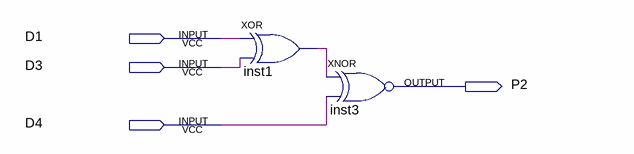
[diagram p0: schematic sheet]
// Quartus schematic generate_p2.bdf as structural Verilog: 2 symbols, 4 pins
module generate_p2 (
  input  D1,
  input  D3,
  input  D4,
  output P2
);

  wire inst1_out;

  xor inst1 (inst1_out, D1, D3);
  xnor inst3 (P2, inst1_out, D4);
endmodule
